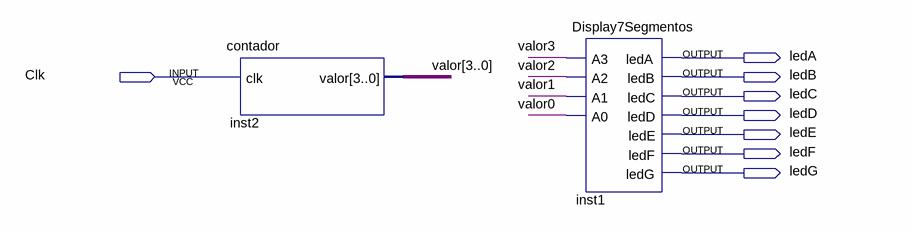
[diagram p0: schematic sheet]
// Quartus schematic Block1.bdf as structural Verilog: 2 symbols, 8 pins
module Block1 (
  input  Clk,
  output ledA,
  output ledB,
  output ledC,
  output ledD,
  output ledE,
  output ledF,
  output ledG
);

  wire [3:0] valor;

  contador inst2 (.clk(Clk), .valor(valor));
  Display7Segmentos inst1 (
    .A3(valor[3]), .A2(valor[2]), .A1(valor[1]), .A0(valor[0]), .ledA(ledA), .ledB(ledB), .ledC(ledC),
    .ledD(ledD), .ledE(ledE), .ledF(ledF), .ledG(ledG));
endmodule
